# EAGLE design display (EAGLE 6.3)
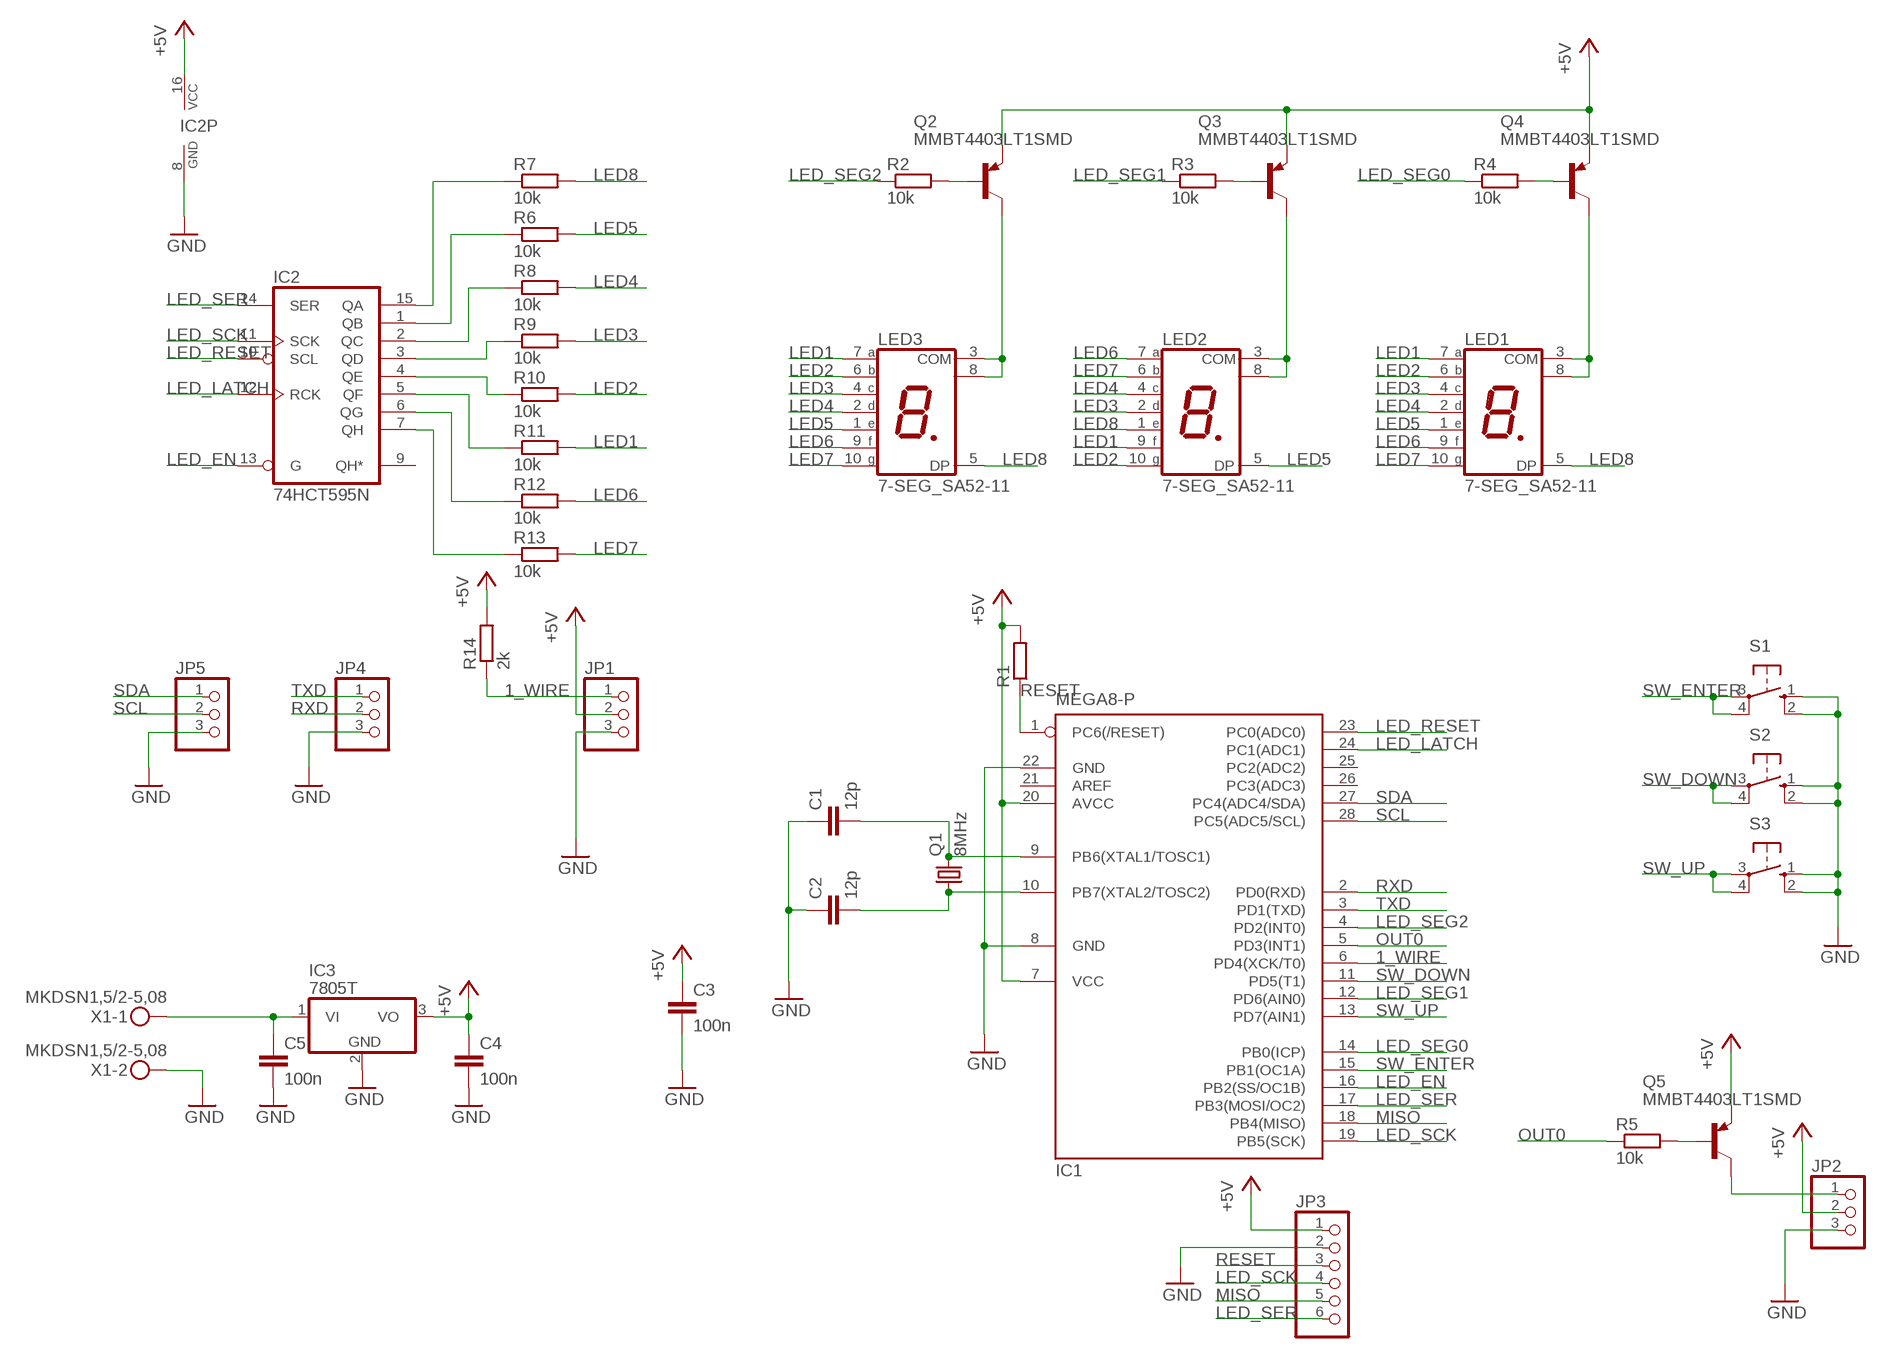
[diagram p0: schematic, sheet 1]

## Parts
C1  12p  C-EU050-035X075  [C050-035X075]
C2  12p  C-EU050-035X075  [C050-035X075]
C3  100n  C-EU050-030X075  [C050-030X075]
C4  100n  C-EU050-030X075  [C050-030X075]
C5  100n  C-EU050-030X075  [C050-030X075]
IC1  MEGA8-P  [DIL28-3]
IC2  74HCT595N  [DIL16]
IC3  7805T  [TO220H]
JP1  PINHD-1X3  [1X03]
JP2  PINHD-1X3  [1X03]
JP3  PINHD-1X6  [1X06]
JP4  PINHD-1X3  [1X03]
JP5  PINHD-1X3  [1X03]
LED1  7-SEG_SA52-11  [SA52-11]
LED2  7-SEG_SA52-11  [SA52-11]
LED3  7-SEG_SA52-11  [SA52-11]
Q1  8MHz  CRYSTALHC49U70  [HC49U70]
Q2  MMBT4403LT1SMD  [SOT23-BEC]
Q3  MMBT4403LT1SMD  [SOT23-BEC]
Q4  MMBT4403LT1SMD  [SOT23-BEC]
Q5  MMBT4403LT1SMD  [SOT23-BEC]
R1  R-EU_R1206  [R1206]
R2  10k  R-EU_M1206  [M1206]
R3  10k  R-EU_M1206  [M1206]
R4  10k  R-EU_M1206  [M1206]
R5  10k  R-EU_M1206  [M1206]
R6  10k  R-EU_M1206  [M1206]
R7  10k  R-EU_M1206  [M1206]
R8  10k  R-EU_M1206  [M1206]
R9  10k  R-EU_M1206  [M1206]
R10  10k  R-EU_M1206  [M1206]
R11  10k  R-EU_M1206  [M1206]
R12  10k  R-EU_M1206  [M1206]
R13  10k  R-EU_M1206  [M1206]
R14  2k  R-EU_M1206  [M1206]
S1  10-XX  [B3F-10XX]
S2  10-XX  [B3F-10XX]
S3  10-XX  [B3F-10XX]
X1  MKDSN1,5/2-5,08  [MKDSN1,5/2-5,08]

## Nets
1_WIRE: IC1.6(PD4(XCK/T0)) JP1.1 R14.1
+5V: C3.1 C4.1 IC1.7(VCC) IC1.20(AVCC) IC2.16(VCC) IC3.3(VO) JP1.2 JP2.2 JP3.1 Q2.E Q3.E Q4.E Q5.E R1.2 R14.2
GND: C1.1 C2.1 C3.2 C4.2 C5.2 IC1.8(GND) IC1.22(GND) IC2.8(GND) IC3.2(GND) JP1.3 JP2.3 JP3.2 JP4.3 JP5.3 S1.1(S) S1.2(S1) S2.1(S) S2.2(S1) S3.1(S) S3.2(S1) X1.2
LED1: LED1.7(A) LED2.9(F) LED3.7(A) R11.2
LED2: LED1.6(B) LED2.10(G) LED3.6(B) R10.2
LED3: LED1.4(C) LED2.2(D) LED3.4(C) R9.2
LED4: LED1.2(D) LED2.4(C) LED3.2(D) R8.2
LED5: LED1.1(E) LED2.5(DP) LED3.1(E) R6.2
LED6: LED1.9(F) LED2.7(A) LED3.9(F) R12.2
LED7: LED1.10(G) LED2.6(B) LED3.10(G) R13.2
LED8: LED1.5(DP) LED2.1(E) LED3.5(DP) R7.2
LED_EN: IC1.16(PB2(SS/OC1B)) IC2.13(G)
LED_LATCH: IC1.24(PC1(ADC1)) IC2.12(RCK)
LED_RESET: IC1.23(PC0(ADC0)) IC2.10(SCL)
LED_SCK: IC1.19(PB5(SCK)) IC2.11(SCK) JP3.4
LED_SEG0: IC1.14(PB0(ICP)) R4.1
LED_SEG1: IC1.12(PD6(AIN0)) R3.1
LED_SEG2: IC1.4(PD2(INT0)) R2.1
LED_SER: IC1.17(PB3(MOSI/OC2)) IC2.14(SER) JP3.6
MISO: IC1.18(PB4(MISO)) JP3.5
N$1: C1.2 IC1.9(PB6(XTAL1/TOSC1)) Q1.2
N$2: C2.2 IC1.10(PB7(XTAL2/TOSC2)) Q1.1
N$3: LED3.3(COM) LED3.8(COM) Q2.C
N$4: IC2.15(QA) R7.1
N$5: LED1.3(COM) LED1.8(COM) Q4.C
N$6: LED2.3(COM) LED2.8(COM) Q3.C
N$7: Q2.B R2.2
N$8: Q3.B R3.2
N$9: Q4.B R4.2
N$10: Q5.B R5.2
N$11: JP2.1 Q5.C
N$12: IC2.1(QB) R6.1
N$13: IC2.2(QC) R8.1
N$14: IC2.3(QD) R9.1
N$15: IC2.4(QE) R10.1
N$16: IC2.5(QF) R11.1
N$17: IC2.6(QG) R12.1
N$18: IC2.7(QH) R13.1
N$19: C5.1 IC3.1(VI) X1.1
OUT0: IC1.5(PD3(INT1)) R5.1
RESET: IC1.1(PC6(/RESET)) JP3.3 R1.1
RXD: IC1.2(PD0(RXD)) JP4.2
SCL: IC1.28(PC5(ADC5/SCL)) JP5.2
SDA: IC1.27(PC4(ADC4/SDA)) JP5.1
SW_DOWN: IC1.11(PD5(T1)) S2.3(P) S2.4(P1)
SW_ENTER: IC1.15(PB1(OC1A)) S1.3(P) S1.4(P1)
SW_UP: IC1.13(PD7(AIN1)) S3.3(P) S3.4(P1)
TXD: IC1.3(PD1(TXD)) JP4.1
Unconnected: IC1.21(AREF) IC1.25(PC2(ADC2)) IC1.26(PC3(ADC3)) IC2.9(QH*)

## Library data of the parts
C1-C5 = resistor:C-EU: CAPACITOR, European symbol
IC1 = atmel:MEGA8-P: MICROCONTROLLER 8 Kbytes FLASH, 1 kbytes SRAM, 512 bytes EEPROM, USART, 4-channel 10 bit ADC, 2-channel 8 bit ADC Pin compatible with Atmega48, ATMega88, ATMega168 Source: avr.lbr; OC_FARNELL: unknown; OC_NEWARK: unknown
IC2 = 74xx-eu:74*595: 8-bit SHIFT REGISTER, output latch
IC3 = linear:78*: Positive VOLTAGE REGULATOR Source: http://cache.national.com/ds/LM/LM78L05.pdf http://www.fairchildsemi.com/ds/LM/LM7805.pdf
JP1 JP2 JP4 JP5 = pinhead:PINHD-1X3: PIN HEADER
JP3 = pinhead:PINHD-1X6: PIN HEADER
LED1-LED3 = display-kingbright:7-SEG_: Kingbright 14.2mm (0.56 INCH) SINGLE DIGIT NUMERIC DUISPLAY Source: SA56-11EWA(Ver1189471036.pdf; OC_FARNELL: unknown; OC_NEWARK: unknown
Q1 = crystal:CRYSTAL: CRYSTAL; OC_FARNELL: unknown; OC_NEWARK: unknown
Q2-Q5 = transistor-pnp:MMBT4403*: PNP Transistror
R1-R14 = resistor:R-EU_: RESISTOR, European symbol
S1-S3 = switch-omron:10-XX: OMRON SWITCH; MPN: B3F-1000; OC_FARNELL: 176432; OC_NEWARK: 36M3542
X1 = con-phoenix-508:MKDSN1,5/2-5,08: MKDSN 1,5/ 2-5,08 Printklemme Nennstrom: 13,5 A Nennspannung: 250 V Rastermaß: 5,08 mm Polzahl: 2 Anschlussart: Schraubanschluss Montage: Löten Anschlussrichtung Leiter/Platine: 0 ° Artikelnummer: 1729128 Source: http://eshop.phoenixcontact.com .. 1729128.pdf; MPN: MKDSN 1,5/2-5.08; OC_FARNELL: 1792903; OC_NEWARK: 30M2397

## Board
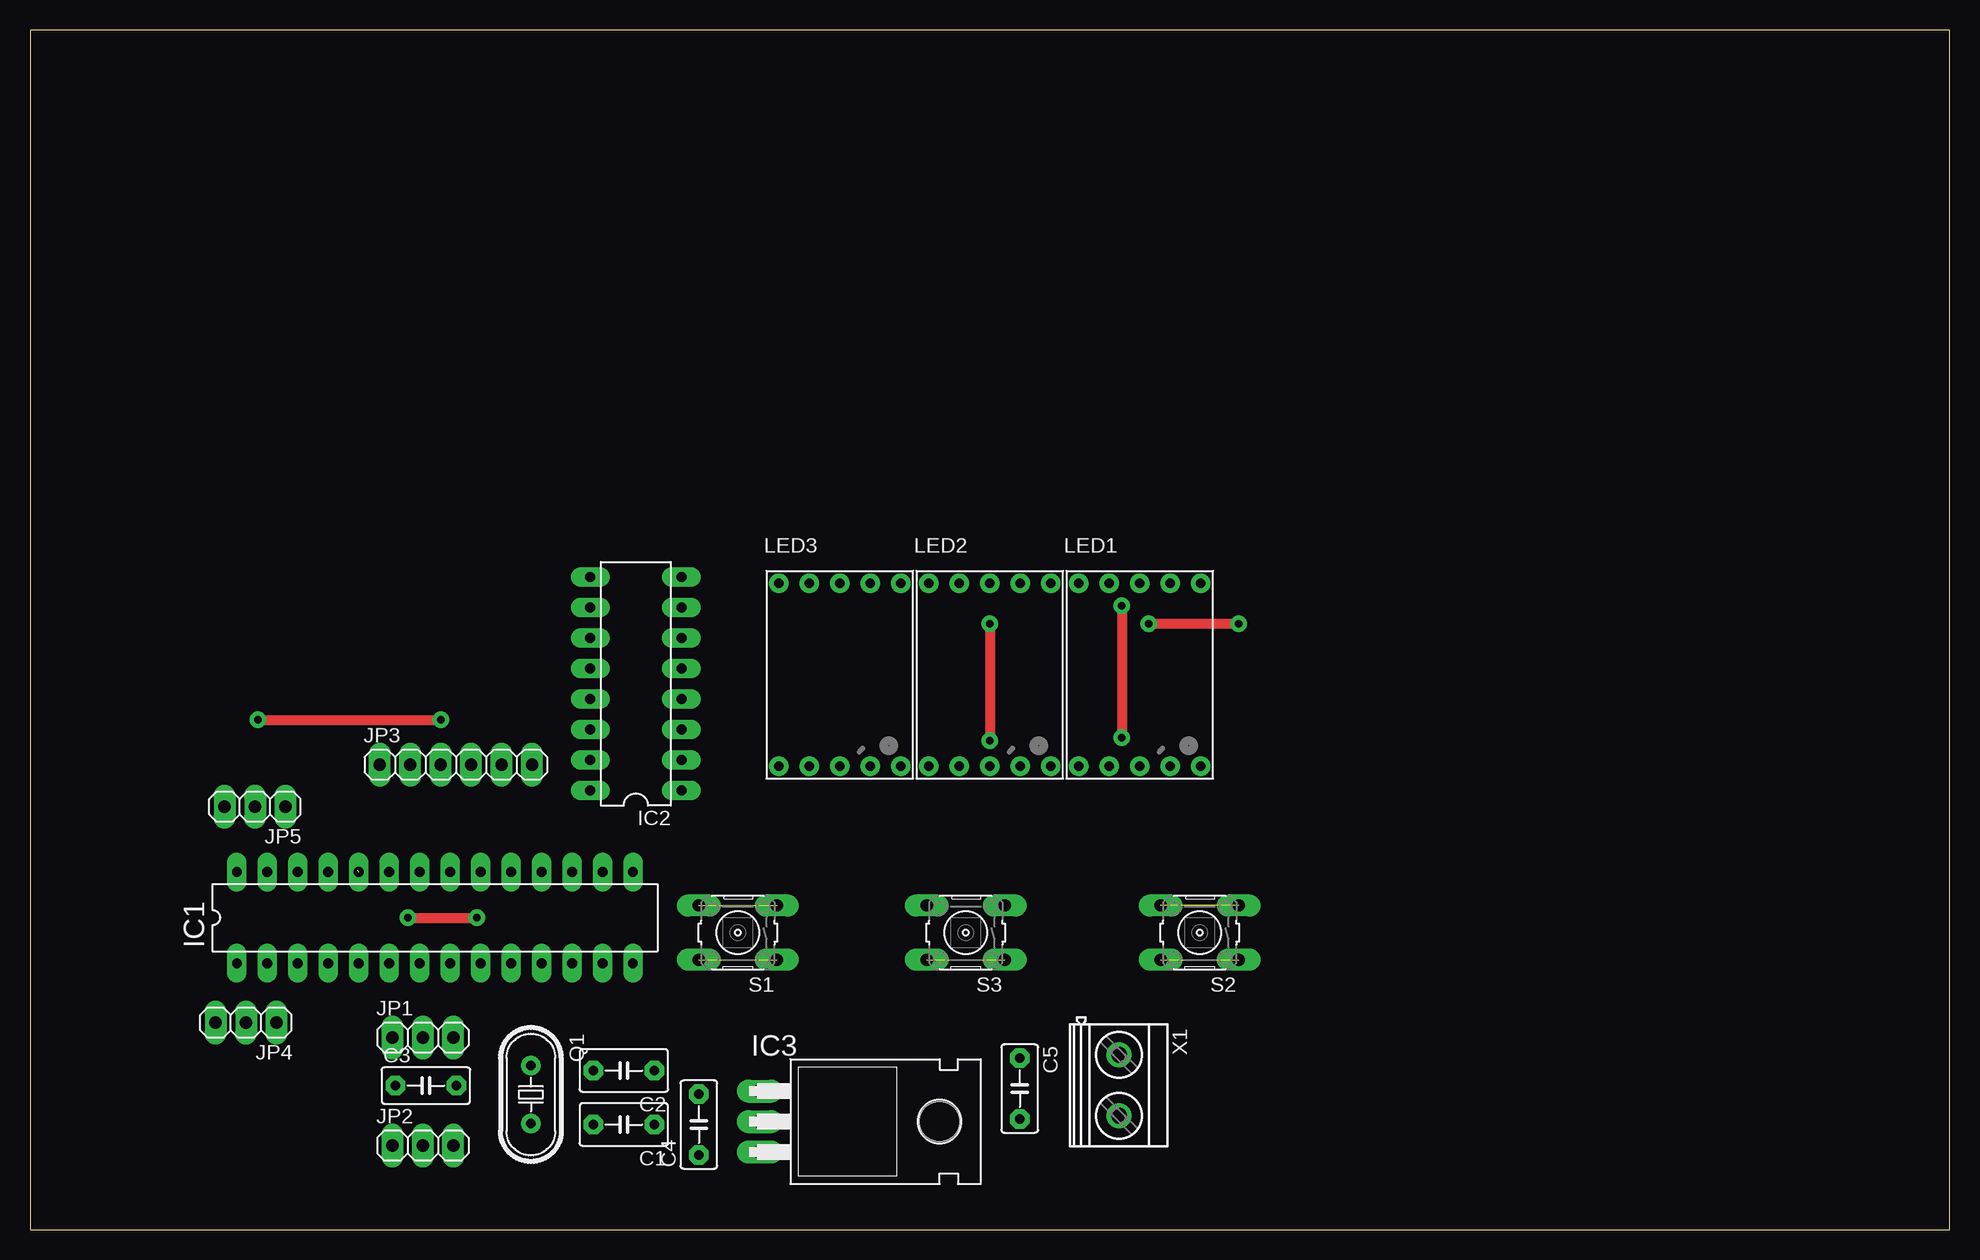
[diagram p1: board, top side]
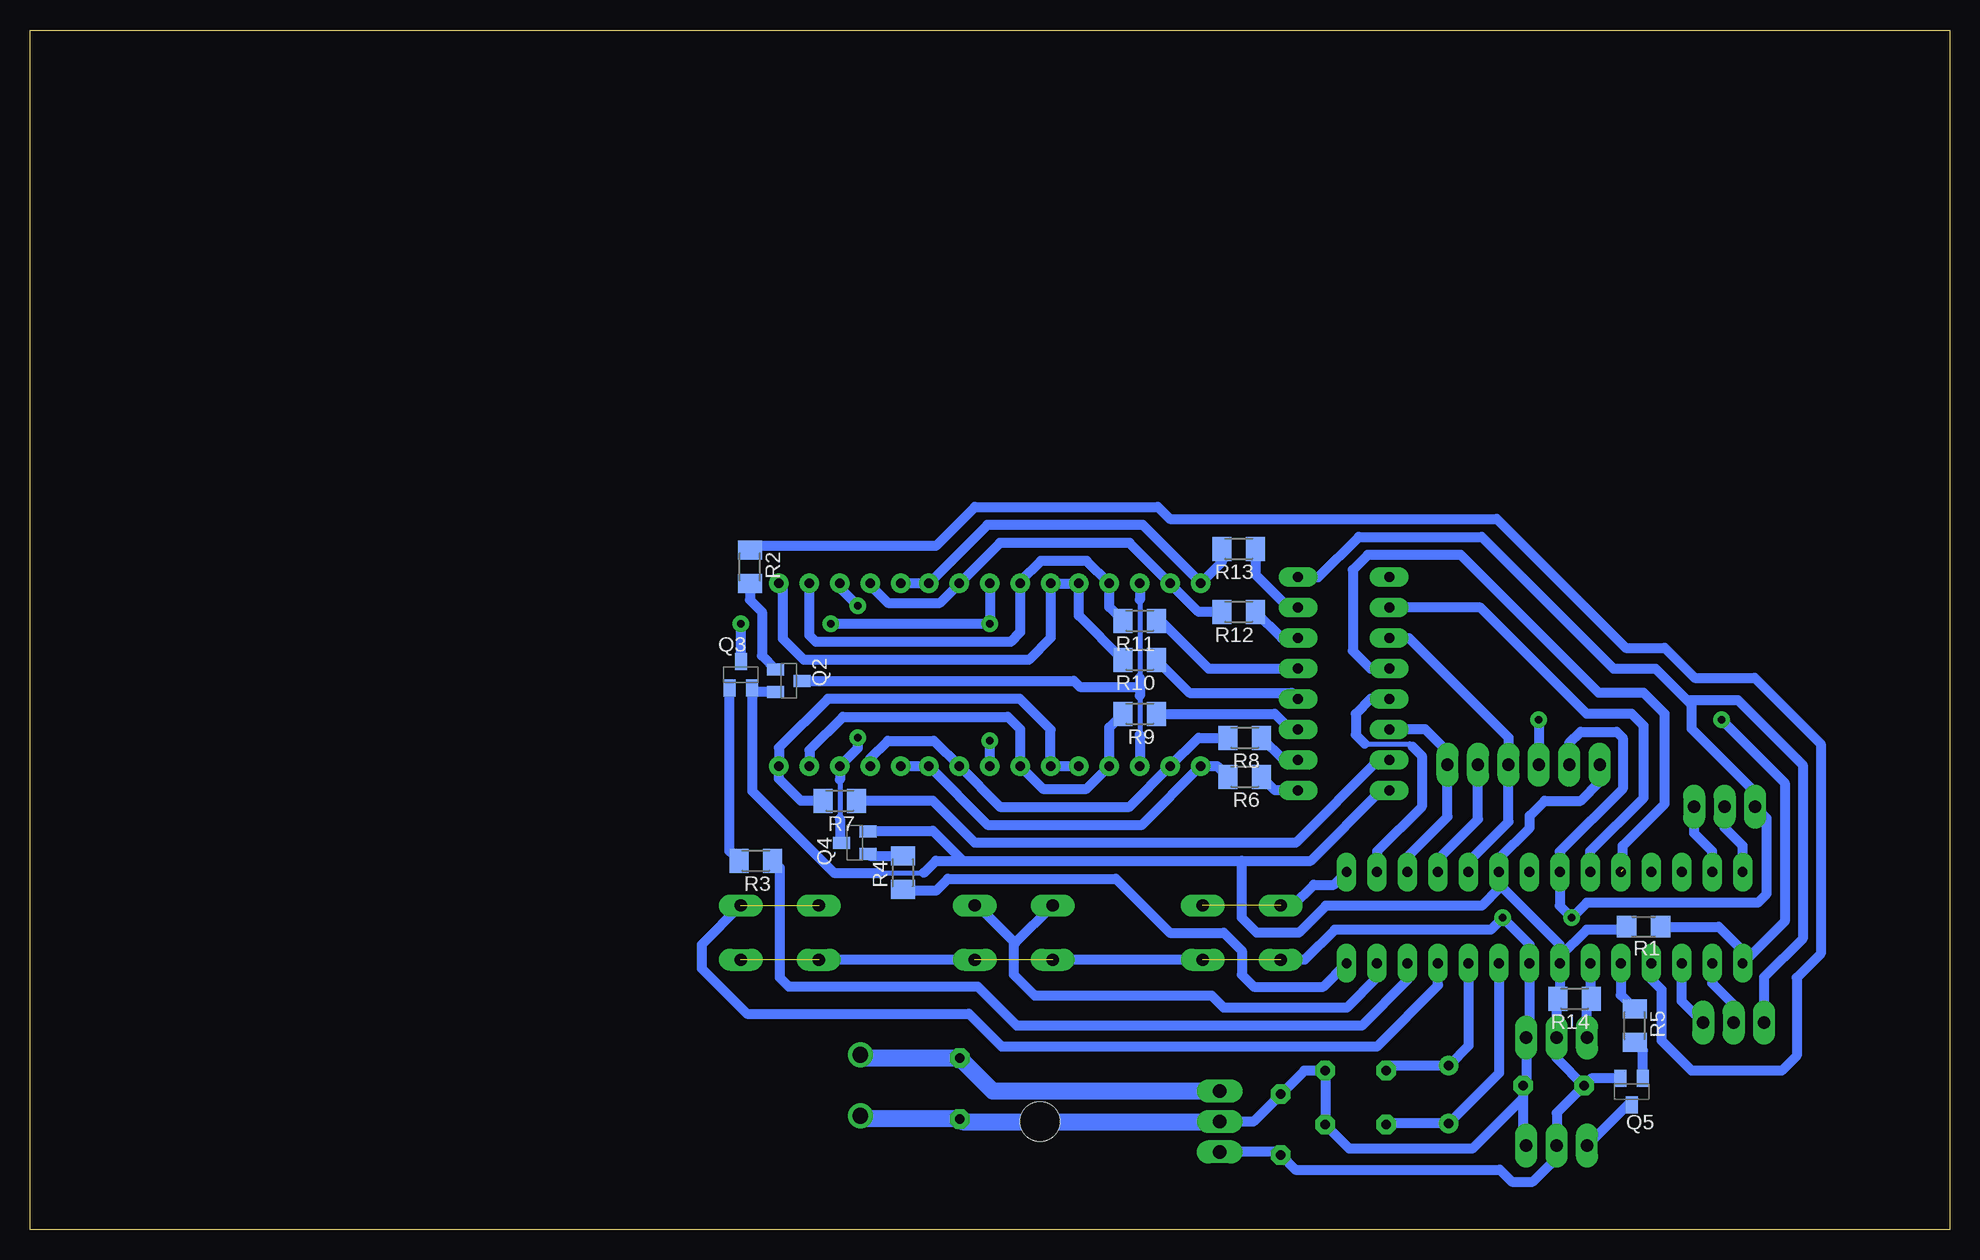
[diagram p2: board, bottom side, seen from below]

Size 160 x 100 mm. Coordinates in mm from the lower left corner, seen from the top.
Outline: 0,0 160,0 160,100 0,100 0,0
Copper layers (1*16): Top 0.035mm / dielectric 1.5mm / Bottom 0.035mm
Design rules "default *": minimum track width 10mil, minimum drill 24mil, track to track 8mil, track to pad 8mil, pad to pad 8mil, via to via 8mil, smd to smd 8mil, copper to edge 40mil, drill to drill 8mil, minimum pad ring 16mil, minimum via ring 16mil, stop-mask expansion 4mil, vias tented up to drill 0mil, thermal gap 10mil

### Footprints (pad centres in the part's own frame; a part is rotated, then mirrored left to right if it is on the bottom)
C050-035X075 = drill 0.813 octagon: 1 -2.54,0; 2 2.54,0
C050-030X075 = drill 0.813 octagon: 1 -2.54,0; 2 2.54,0
DIL28-3 = drill 0.813 long: 1 -16.51,-3.81; 2 -13.97,-3.81; 3 -11.43,-3.81; 4 -8.89,-3.81; 5 -6.35,-3.81; 6 -3.81,-3.81; 7 -1.27,-3.81; 8 1.27,-3.81; 9 3.81,-3.81; 10 6.35,-3.81; 11 8.89,-3.81; 12 11.43,-3.81; 13 13.97,-3.81; 14 16.51,-3.81; 15 16.51,3.81; 16 13.97,3.81; 17 11.43,3.81; 18 8.89,3.81; 19 6.35,3.81; 20 3.81,3.81; 21 1.27,3.81; 22 -1.27,3.81; 23 -3.81,3.81; 24 -6.35,3.81; 25 -8.89,3.81; 26 -11.43,3.81; 27 -13.97,3.81; 28 -16.51,3.81
DIL16 = drill 0.813 long: 1 -8.89,-3.81; 2 -6.35,-3.81; 3 -3.81,-3.81; 4 -1.27,-3.81; 5 1.27,-3.81; 6 3.81,-3.81; 7 6.35,-3.81; 8 8.89,-3.81; 9 8.89,3.81; 10 6.35,3.81; 11 3.81,3.81; 12 1.27,3.81; 13 -1.27,3.81; 14 -3.81,3.81; 15 -6.35,3.81; 16 -8.89,3.81
TO220H = drill 1.118 long: 1 -2.54,-10.16; 2 0,-10.16; 3 2.54,-10.16 | hole 3.302: 0,4.826
1X03 = drill 1.016 long: 1 -2.54,0; 2 0,0; 3 2.54,0
1X06 = drill 1.016 long: 1 -6.35,0; 2 -3.81,0; 3 -1.27,0; 4 1.27,0; 5 3.81,0; 6 6.35,0
SA52-11 = drill 0.8: 1 -5.08,-7.62; 2 -2.54,-7.62; 3 0,-7.62; 4 2.54,-7.62; 5 5.08,-7.62; 6 5.08,7.62; 7 2.54,7.62; 8 0,7.62; 9 -2.54,7.62; 10 -5.08,7.62
HC49U70 = drill 0.813: 1 -2.413,0; 2 2.413,0
SOT23-BEC = smd 1 x 1.4: B -0.95,-1.1; C 0,1.1; E 0.95,-1.1
R1206 = smd 1.6 x 1.803: 1 -1.422,0; 2 1.422,0
M1206 = smd 1.6 x 2: 1 -1.4,0; 2 1.4,0
B3F-10XX = drill 1.016 long: 1 -3.251,2.261; 2 3.251,2.261; 3 -3.251,-2.261; 4 3.251,-2.261
MKDSN1,5/2-5,08 = drill 1.3 pad 2: 1 -2.561,0.025; 2 2.519,0.025

### Placement (x,y rotation side)
C1  49.5,8.75 180 top
C2  49.5,13.25 180 top
C3  33,12 0 top
C4  55.75,8.75 90 top
C5  82.5,11.75 270 top
IC1  33.75,26 0 top
IC2  50.5,45.5 90 top
IC3  71,9 270 top
JP1  32.75,16 0 top
JP2  32.75,7 0 top
JP3  35.5,38.75 0 top
JP4  18,17.25 180 top
JP5  18.75,35.25 180 top
LED1  92.5,46.25 0 top
LED2  80,46.25 0 top
LED3  67.5,46.25 0 top
Q1  41.75,11.25 270 top
Q2  96.75,45.75 270 bottom
Q3  100.75,46.25 0 bottom
Q4  91.25,32.25 90 bottom
Q5  26.5,11.5 180 bottom
R1  25.5,25.25 180 bottom
R2  100,55.25 270 bottom
R3  99.5,30.75 180 bottom
R4  87.25,29.75 90 bottom
R5  26.25,17 270 bottom
R6  58.75,37.75 180 bottom
R7  92.5,35.75 180 bottom
R8  58.75,41 180 bottom
R9  67.5,43 180 bottom
R10  67.5,47.5 180 bottom
R11  67.5,50.75 180 bottom
R12  59.25,51.5 180 bottom
R13  59.25,56.75 180 bottom
R14  31.25,19.25 180 bottom
S1  59,24.75 180 top
S2  97.5,24.75 180 top
S3  78,24.75 180 top
X1  90.75,12 270 top

### Tracks (layer width: path | path; a pad name or v marks a point on that pad's centre or on a via)
1_WIRE
  Bottom 0.813: IC1.6 29.94,19.34 R14.1 30.21,18.89 JP1.1
+5V
  Bottom 0.406: 89.25,29.75 85.5,29.75
  Bottom 0.813: R1.2 27.17,25 30.25,25 32.48,22.77 | 32.48,22.77 IC1.7 32.48,19.42 R14.2 32.75,19.15 JP1.2 32.75,14.29 C3.1 | IC3.3 56,6.46 C4.1 54.54,5 37.5,5 36.5,4 34.75,4 32.75,6 JP2.2 32.75,9.71 C3.1 | IC1.20 37.56,30.94 35,33.5 35,34.5 33.75,35.75 30.75,35.75 29.15,37.35 JP3.1 | Q5.E 29.86,12.6 C3.1 | Q4.E 90.1,33.25 84.75,33.25 82.25,30.75 | 82.25,30.75 59,30.75 | 59,30.75 53.25,30.75 47.39,36.61 IC2.16 | 89.25,29.75 93,29.75 99.8,36.55 Q3.E 99.45,44.8 Q2.E | 85.5,29.75 84.5,30.75 82.25,30.75 | IC1.20 37.56,28.44 39,27 52,27 54.25,24.75 57.75,24.75 59,26 59,30.75 | 32.48,22.77 32.48,23.73 37.56,28.81 IC1.20
GND  (via drill 0.6)  (3 unrouted)
  Top 0.813: v31.5,26 v37.25,26
  Bottom 0.813: IC3.2 58.04,9 C4.2 53.79,13.25 C2.1 C1.1 50.04,6.75 39.79,6.75 35.54,11 C3.2 | S1.1 S3.2 | S3.1 S2.2 | IC2.8 52.61,54.39 49.25,57.75 39,57.75 28,46.75 24.5,46.75 21.88,44.12 | JP3.2 31.69,40.56 30.75,41.5 27.75,41.5 27.25,41 27.25,36.75 32.48,31.52 IC1.22 32.48,26.98 v31.5,26 30.25,27.25 16,27.25 15.25,28 15.25,34.29 JP5.3 16.21,36.46 21.5,41.75 21.5,43.75 21.88,44.12 | 21.88,44.12 17.62,44.12 12.25,38.75 12.25,24.25 15.46,21.04 JP4.3 | C3.2 35.29,12.25 JP1.3 35.02,16.27 IC1.8 35.02,23.77 v37.25,26 38.25,25 51.25,25 53.76,22.49 S1.2 | JP2.3 35.54,7.25 C3.2
  Bottom 1.422: IC3.2 82.29,9 C5.2 90.5,9.21 X1.2
LED1
  Bottom 0.813: R11.2 70.04,51.89 LED3.7 71.92,55.75 75.75,55.75 77.46,54.04 LED2.9 77.46,49.79 78.25,49 94.5,49 95.04,49.54 LED1.7
LED2
  Bottom 0.813: R10.2 72.58,51.18 LED3.6 LED2.10 74.92,49.33 76.75,47.5 95.5,47.5 97.25,49.25 97.25,53.54 LED1.6
LED3
  Bottom 0.813: R9.2 70.04,41.86 LED3.4 71.92,36.75 75.58,36.75 LED2.2 77.46,41.71 78.5,42.75 92.25,42.75 95.04,39.96 LED1.4
LED4
  Bottom 0.813: LED1.2 89.96,39.29 88.5,40.75 84.66,40.75 LED2.4 79.16,35.25 68.34,35.25 LED3.2 62.59,41 R8.2
LED5
  Bottom 0.813: LED1.1 LED2.5 80.2,33.75 67.3,33.75 LED3.1 61.03,38.63 R6.2
LED6
  Bottom 0.813: R12.2 62.59,51.5 LED3.9 68.34,57.25 79.16,57.25 LED2.7 84.16,52.25 88.5,52.25 89.96,53.71 LED1.9
LED7
  Bottom 0.813: R13.2 60.65,55.64 LED3.10 62.42,53.92 67.25,58.75 80.2,58.75 LED2.6 LED1.10
LED8
  Bottom 0.813: LED3.5 LED2.1 74.92,41.67 77.5,44.25 93.5,44.25 97.58,40.17 LED1.5 97.58,37.58 95.75,35.75 R7.2
LED_EN
  Bottom 0.406: 48.75,40.5 45,40.5 44.75,40.25
  Bottom 0.813: IC2.13 48.27,44.23 49.5,43 49.5,41.25 48.75,40.5 | 44.75,40.25 44,39.5 44,35.25 47.72,31.53 IC1.16
LED_LATCH  (1 unrouted)
  Bottom 0.813: IC2.12 48.27,46.77 49.75,48.25 49.75,55 48.5,56.25 40.75,56.25 29.25,44.75 25.5,44.75 23.75,43 23.75,35.5 27.25,32 27.25,29.96
LED_RESET
  Bottom 0.813: IC1.23 29.94,31.56 25.5,36 25.5,42 26.5,43 30.25,43 39.1,51.85 IC2.10
LED_SCK
  Bottom 0.813: IC2.11 45.06,49.31 36.77,41.02 JP3.4 36.77,33.98 40.1,30.65 IC1.19
LED_SEG0
  Bottom 0.813: R4.1 87.15,28.25 84.5,28.25 83.5,29.25 69.5,29.25 65,24.75 60.5,24.75 59,23.25 59,21.25 58,20.25 52.2,20.25 IC1.14
LED_SEG1
  Bottom 0.813: IC1.12 45.18,20.82 49,17 77.75,17 78,17.25 78.38,17.62 81,20.25 96.75,20.25 97.5,21 97.5,30.15 R3.1
LED_SEG2
  Bottom 0.813: R2.1 99.65,57 84.5,57 81.25,60.25 66,60.25 65,59.25 37.75,59.25 27,48.5 23.75,48.5 21.25,46 16.25,46 10.75,40.5 10.75,23 12.75,21 12.75,14.5 14,13.25 21.5,13.25 24,15.75 24,20 24.86,20.86 IC1.4
LED_SER
  Bottom 0.813: IC2.14 43.69,41.69 41.85,39.85 JP3.6 41.85,34.4 45.18,31.07 IC1.17
MISO
  Bottom 0.813: IC1.18 42.64,30.86 39.31,34.19 JP3.5
N$1
  Bottom 0.813: C1.2 46.87,8.84 Q1.2 37.56,13.03 IC1.9
N$2
  Bottom 0.813: C2.2 46.55,13.66 Q1.1 40.1,15.31 IC1.10
N$3
  Bottom 0.406: 67.5,52.5 67.5,46 | 67.5,44.5 67.5,41.25
  Bottom 0.813: LED3.8 67.5,52.5 | 67.5,41.25 LED3.3 | Q2.C 73,45.75 72.5,45.25 67.5,45.25 | 67.5,46 67.5,45.25 | 67.5,45.25 67.5,44.5
N$4
  Bottom 0.813: IC2.15 47.6,39.15 54.5,32.25 81.25,32.25 84.75,35.75 R7.1
N$5  (via drill 0.6)
  Top 0.813: v91,52 v91,41
  Bottom 0.406: 92.5,37.5 92.5,34.25
  Bottom 0.813: LED1.8 92.5,53.5 v91,52 | v91,41 91,40.13 LED1.3 92.5,37.5 | 92.5,34.25 92.5,32.4 Q4.C
N$6  (via drill 0.6)
  Top 0.813: v100.75,50.5 v93.25,50.5 | v80,50.5 v80,40.75
  Bottom 0.813: Q3.C v100.75,50.5 | LED2.3 v80,40.75 | LED2.8 v80,50.5 v93.25,50.5
N$7
  Bottom 0.813: R2.2 100,52.5 99,51.5 99,47.85 Q2.B
N$8
  Bottom 0.813: R3.2 101.7,31.55 Q3.B
N$9
  Bottom 0.813: Q4.B 90,31.15 R4.2
N$10
  Bottom 0.813: Q5.B 25.55,14.9 R5.2
N$11
  Bottom 0.813: Q5.C 26.81,10.4 JP2.1
N$12
  Bottom 0.813: IC2.1 56.21,36.61 R6.1
N$13
  Bottom 0.813: IC2.2 55.5,39.15 R8.1
N$14
  Bottom 0.813: R9.1 56.25,43 54.94,41.69 IC2.3
N$15
  Bottom 0.813: R10.1 63.35,44.75 54.83,44.75 IC2.4
N$16
  Bottom 0.813: R11.1 65.75,50.75 61.77,46.77 IC2.5
N$17
  Bottom 0.813: IC2.6 55.66,49.31 R12.1
N$18
  Bottom 0.813: R13.1 57.85,54.6 55.1,51.85 IC2.7
N$19
  Bottom 1.422: IC3.1 79.75,11.54 C5.1 90.5,14.29 X1.1
OUT0
  Bottom 0.813: IC1.5 27.4,19.55 R5.1
RESET  (via drill 0.6)
  Top 0.813: v19,42.5 v34.25,42.5
  Bottom 0.813: R1.1 19.25,25.25 17.24,23.24 IC1.1 | IC1.1 17.24,22.26 | v34.25,42.5 34.23,42.48 JP3.3 | v19,42.5 13.75,37.25 13.75,25.68 IC1.1
RXD
  Bottom 0.813: IC1.2 19.78,20.53 18,18.75 JP4.2
SCL
  Bottom 0.813: IC1.28 17.24,31.99 18.75,33.5 JP5.2
SDA
  Bottom 0.813: IC1.27 19.78,31.53 21.29,33.04 JP5.1
SW_DOWN  (1 unrouted)
  Bottom 0.813: IC1.11 42.64,20.36 47.75,15.25 79,15.25 81.75,18 100.25,18 104,21.75 104,23.76 S2.3
SW_ENTER  (1 unrouted)
  Bottom 0.813: S1.4 54.74,27.01 53,28.75 51.32,28.75 IC1.15
SW_UP
  Bottom 0.813: IC1.13 47.72,21.03 50.25,18.5 60.5,18.5 61.5,19.5 76.25,19.5 78,21.25 78,23.76 77.88,23.88 | 77.88,23.88 S3.4 | S3.3 81.01,27.01 77.88,23.88
TXD
  Bottom 0.813: JP4.1 22.32,19.03 IC1.3